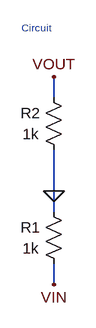
[diagram p0: schematic circuit.asc]
circuit.asc, the LTspice schematic file:
Version 4
SHEET 1 192 480
SYMBOL res 144 352 R0
WINDOW 0 -20 40 Center 2
WINDOW 3 -20 72 Center 2
SYMATTR InstName R1
SYMATTR Value 1k
SYMBOL res 176 288 R180
WINDOW 0 52 72 Center 2
WINDOW 3 52 40 Center 2
SYMATTR InstName R2
SYMATTR Value 1k
WIRE 160 160 160 192
WIRE 160 272 160 336
WIRE 160 336 160 368
WIRE 160 448 160 480
FLAG 160 336 0
FLAG 160 480 VIN
FLAG 160 160 VOUT
TEXT 110 84 Left 1 ;Circuit

The netlist it stands for:
* circuit.asc
R1 0 VIN 1k
R2 0 VOUT 1k
* Circuit
.backanno
.end